# EasyEDA Pro project ProDocument_PCB_普通轴_wsad键盘布局_带灯版_2023-07-23.epro

# Board PCB_普通轴_wsad键盘布局_带灯版
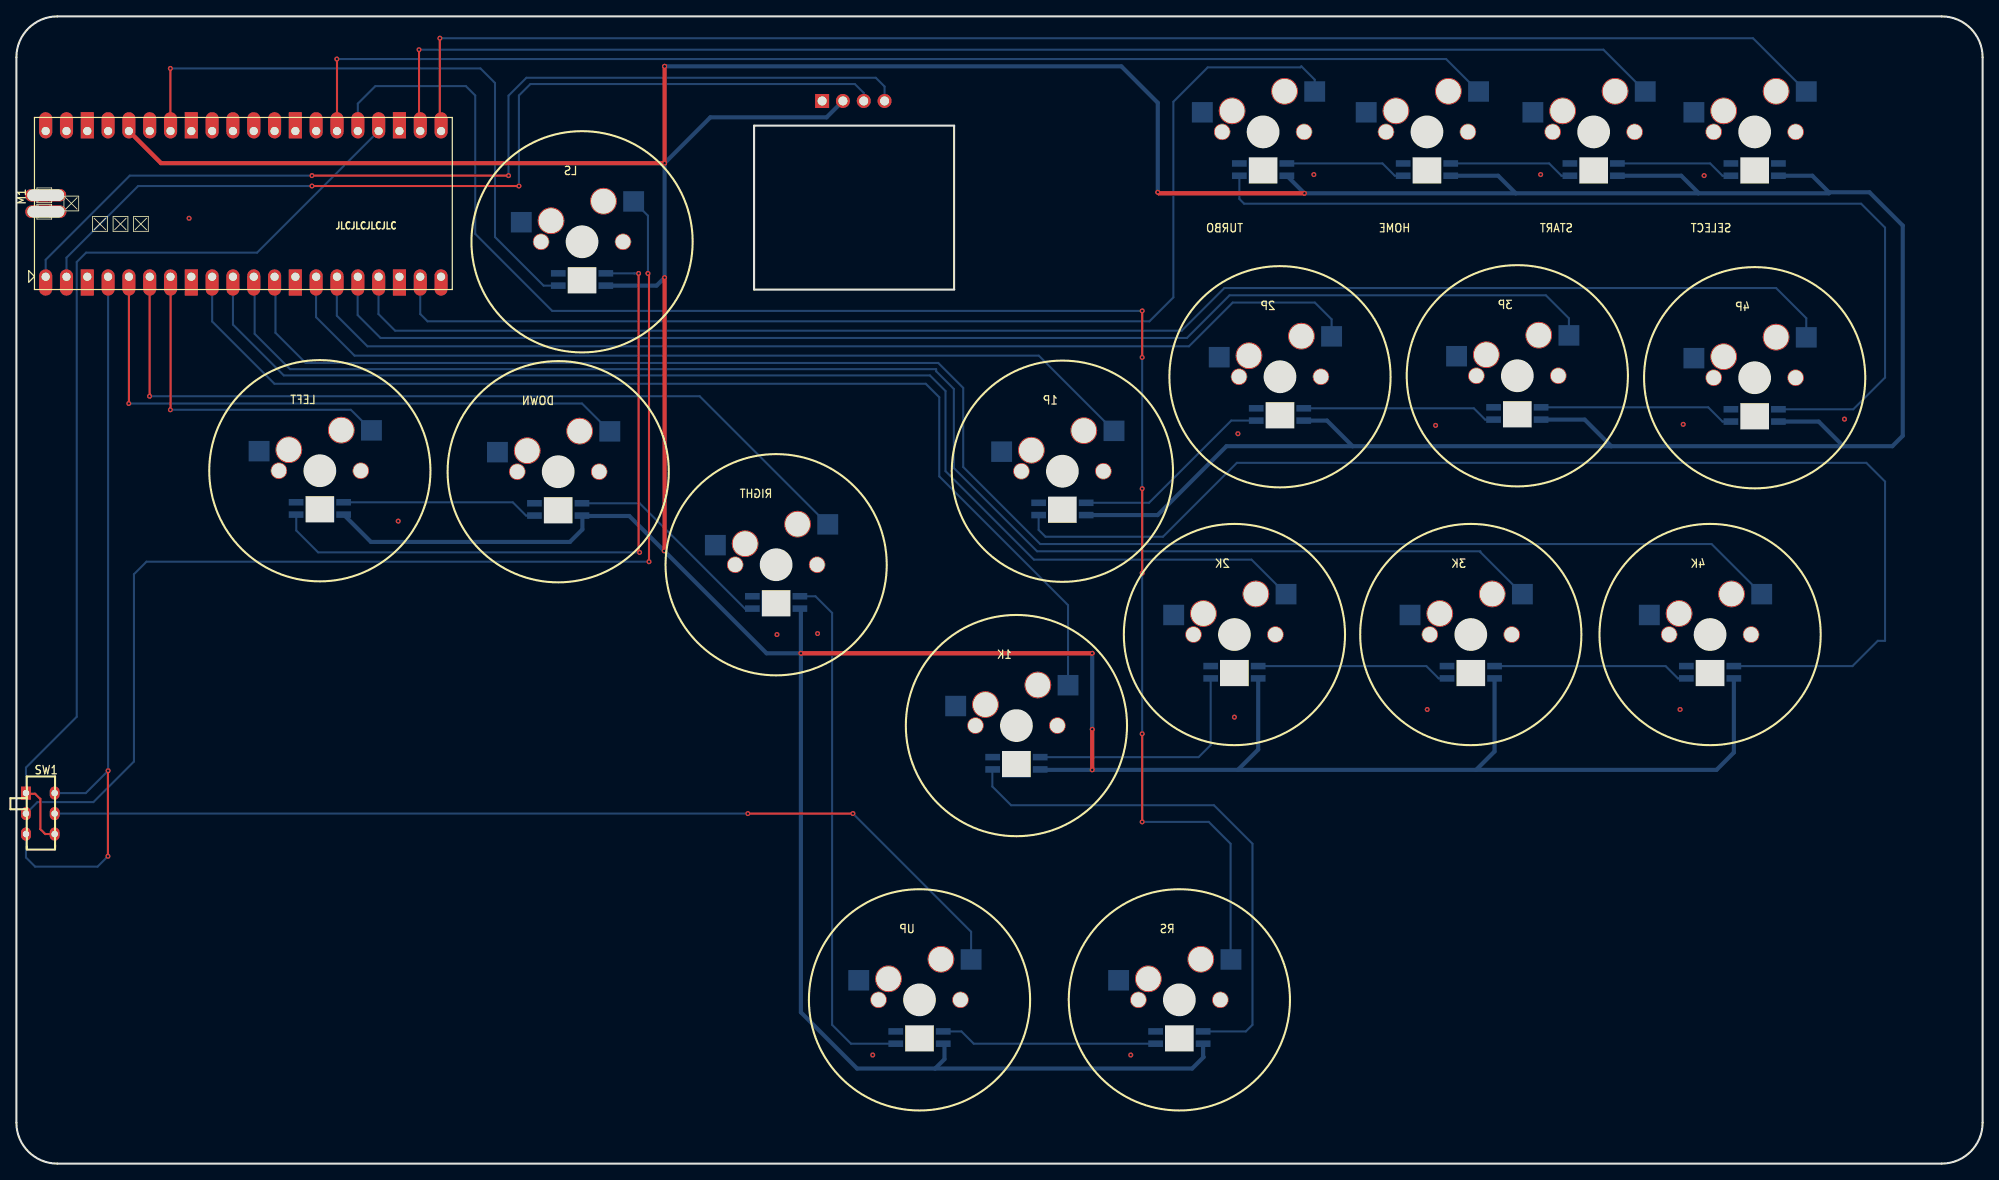
[diagram p0: board, top side]
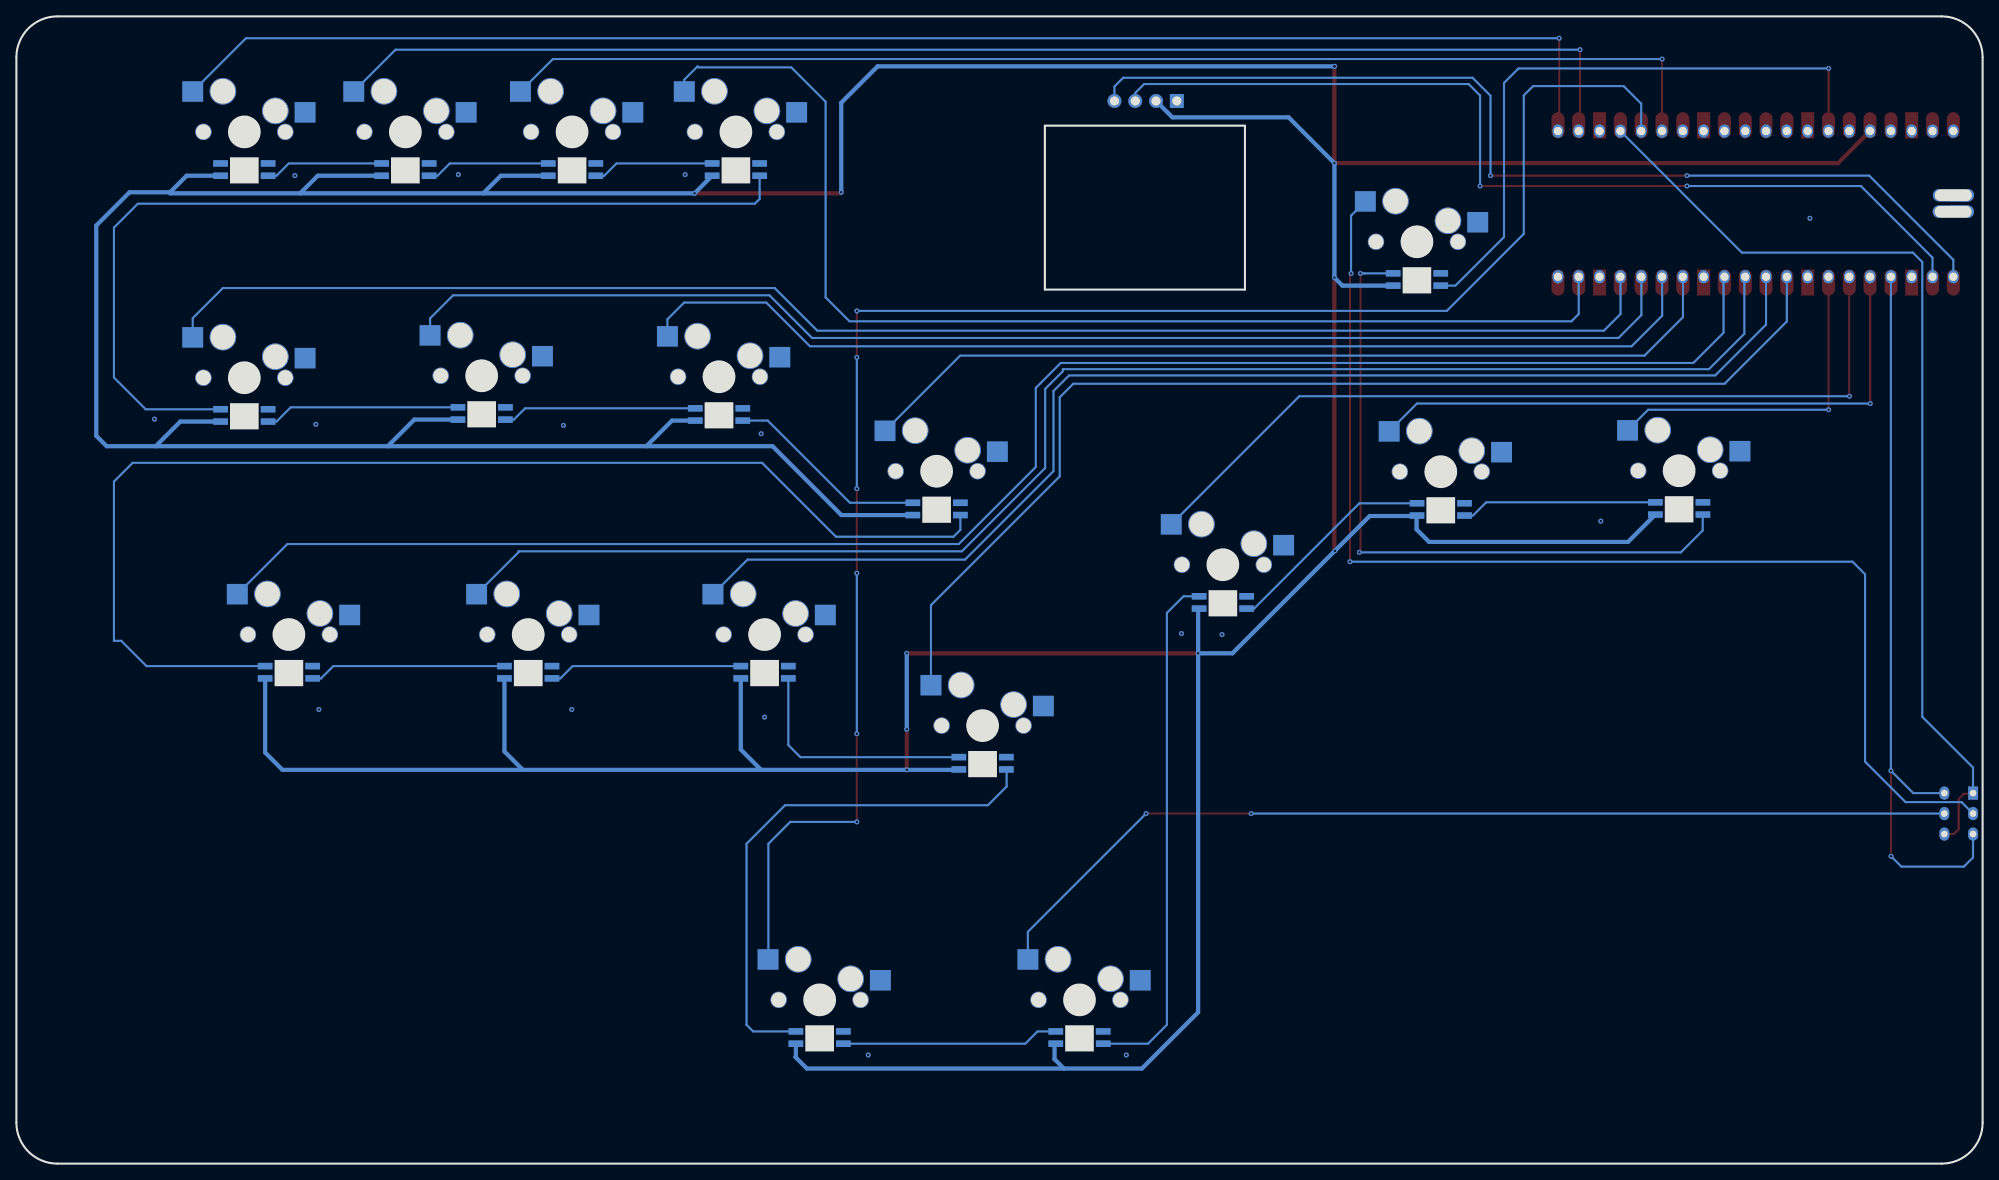
[diagram p1: board, bottom side, seen from below]

Outline 240 x 140 mm; copper layers: Top Layer, Bottom Layer. Coordinates in mm from the lower left corner of the outline.
Outline path: 0,135 arc(1.46,138.54) 5,140 235,140 arc(238.54,138.54) 240,135 240,5 arc(238.54,1.46) 235,0 5,0 arc(1.46,1.46) 0,5 0,135 ; 90.04,126.66 90.04,106.66 114.46,106.66 114.46,126.66 90.04,126.66
Stack: Top Layer 0.035mm - / Dielectric1 1.51mm FR4 er 4.5 / Bottom Layer 0.035mm -

## Design rules (mm)
template: 自定义配置
spacing copperThickness1oz (default): track to track 0.152, other pairs 0.152 to 0.3
spacing copperThickness2oz: track to track 0.203, other pairs 0.152 to 0.3
track width copperThickness1oz (default): min 0.127, default 0.254, max 2.54
track width copperThickness2oz: min 0.203, default 0.254, max 2.54
differential pair differentialPair (default): width min 0.127, default 0.254, max 2.54; gap min 0.152, default 0.152
via viaSize (default): diameter min 0.5, default 0.61, max 10; hole min 0.3, default 0.305, max 6.3

## Placement (name value [footprint] x y rotation side)
1K  1K  [焊接五脚轴1]  122.07 53.45 0 bottom
1P  1P  [焊接五脚轴1]  127.68 84.49 0 bottom
2K  2K  [焊接五脚轴1]  148.68 64.56 0 bottom
2P  2P  [焊接五脚轴1]  154.24 96.02 0 bottom
3K  3K  [焊接五脚轴1]  177.53 64.56 0 bottom
3P  3P  [焊接五脚轴1]  183.21 96.14 0 bottom
4K  4K  [焊接五脚轴1]  206.74 64.56 0 bottom
4P  4P  [焊接五脚轴1]  212.18 95.9 0 bottom
DOWN  S  [焊接五脚轴1]  66.14 84.43 0 bottom
H2  4PIN  [OLED-0.96]  88.41 131.18 0 top
HOME  HOME  [焊接五脚轴1]  172.18 125.9 0 bottom
LEFT  A  [焊接五脚轴1]  37.04 84.55 0 bottom
LS  W  [焊接五脚轴1]  69.05 112.49 0 bottom
M1  -  [PI PICO FIGHTING BOARD]  53.11 106.67 90 top
RIGHT  D  [焊接五脚轴1]  92.74 73.08 0 bottom
RS  W  [焊接五脚轴1]  141.95 19.98 0 bottom
SELECT  W  [焊接五脚轴1]  212.18 125.9 0 bottom
START  W  [焊接五脚轴1]  192.52 125.9 0 bottom
SW1  -  [拔动开关MSK-22D18(2P2T)六脚卧式]  2.92 42.72 0 top
TURBO  TURBO  [焊接五脚轴1]  152.18 125.9 0 bottom
UP  W  [焊接五脚轴1]  110.24 19.98 0 bottom

## Footprints (pads in the part's own frame, mm; a bottom-side part is the same pattern mirrored in y, then rotated)
OLED-0.96
  rect 1.7x1.7 hole 1.1: 1(9.94,-1.5)
  round 1.7 hole 1.1: 2(12.48,-1.5) 3(15.02,-1.5) 4(17.56,-1.5)
PI PICO FIGHTING BOARD
  oval 3.2x1.6 smd: 1(0.86,49.529) 2(0.86,46.99) 4(0.86,41.91) 5(0.86,39.37) 6(0.86,36.83) 7(0.86,34.289) 9(0.86,29.209) 10(0.86,26.669) 11(0.86,24.13) 12(0.86,21.59) 14(0.86,16.509) 15(0.86,13.97) 16(0.86,11.43) 17(0.86,8.889) 19(0.86,3.809) 20(0.86,1.27) 21(20.04,1.27) 22(20.04,3.809) 24(20.04,8.889) 25(20.04,11.43) 26(20.04,13.97) 27(20.04,16.509) 29(20.04,21.59) 30(20.04,24.13) 31(20.04,26.669) 32(20.04,29.209) 34(20.04,34.289) 35(20.04,36.83) 36(20.04,39.37) 37(20.04,41.91) 39(20.04,46.989) 40(20.04,49.529)
  rect 3.2x1.6 smd: 3(0.86,44.45) 8(0.86,31.75) 13(0.86,19.05) 18(0.86,6.35) 23(20.04,6.35) 28(20.04,19.05) 33(20.04,31.75) 38(20.04,44.45)
  oval 1.524x3.429 smd far side: 41(9.499,50.343) 42(11.506,50.343)
  oval 1.6x1.3 hole 1: 43(1.56,49.529) 44(1.56,46.989) 45(1.56,44.45) 46(1.56,41.91) 47(1.56,39.37) 48(1.56,36.83) 49(1.56,34.289) 50(1.56,16.509) 51(1.56,19.049) 52(1.56,21.59) 53(1.56,24.13) 54(1.56,26.669) 55(1.56,29.209) 56(1.56,31.75) 57(1.56,1.27) 58(1.56,3.809) 59(1.56,6.349) 60(1.56,8.889) 61(1.56,11.43) 62(1.56,13.97) 63(19.34,13.97) 64(19.34,11.43) 65(19.34,8.889) 66(19.34,6.349) 67(19.34,3.809) 68(19.34,1.27) 69(19.34,31.75) 70(19.34,29.209) 71(19.34,26.669) 72(19.34,24.13) 73(19.34,21.59) 74(19.34,19.049) 75(19.34,16.509) 76(19.34,34.289) 77(19.34,36.83) 78(19.34,39.37) 79(19.34,41.91) 80(19.34,44.45) 81(19.34,46.989) 82(19.34,49.529)
  oval 1.524x5 hole 1.397x4.5: 83(11.506,49.53) 84(9.499,49.505)
拔动开关MSK-22D18(2P2T)六脚卧式
  rect 1.2x1.6 hole 0.8: 1(-1.75,2.5)
  oval 1.2x1.6 hole 0.8: 2(-1.75,-0.001) 3(-1.75,-2.5) 4(1.75,-2.5) 5(1.75,-0.001) 6(1.75,2.5)
焊接五脚轴1
  rect 2.55x2.5 smd: 1(6.299,-4.928) 2(-7.417,-2.388)
  round 3.251 hole 3: 5(-3.784,-2.566) 8(2.616,-4.953)
  round 2 hole 1.8: 6(5,0) 7(-5,0)
  rect 1.8x0.8 smd: DIN(-2.9,5.351) DOUT(2.9,3.851) GND(-2.9,3.851) VCC(2.9,5.351)

## Nets
5V: M1.40 M1.82
GND: 1K.2 1K.GND 1P.2 1P.GND 2K.2 2K.GND 2P.2 2P.GND 3K.2 3K.GND 3P.2 3P.GND 4K.2 4K.GND 4P.2 4P.GND DOWN.2 DOWN.GND H2.1 HOME.2 HOME.GND LEFT.2 LEFT.GND LS.2 LS.GND M1.3 M1.8 M1.13 M1.18 M1.23 M1.28 M1.33 M1.38 M1.45 M1.51 M1.56 M1.59 M1.66 M1.69 M1.74 M1.80 RIGHT.2 RIGHT.GND RS.2 RS.GND SELECT.2 SELECT.GND START.2 START.GND TURBO.2 TURBO.GND UP.2 UP.GND
VCC: 1K.VCC 1P.VCC 2K.VCC 2P.VCC 3K.VCC 3P.VCC 4K.VCC 4P.VCC DOWN.VCC H2.2 HOME.VCC LEFT.VCC LS.VCC M1.36 M1.78 RIGHT.VCC RS.VCC SELECT.VCC START.VCC TURBO.VCC UP.VCC
1K: 1K.1 M1.9 M1.55
1P: 1P.1 M1.14 M1.50
2K: 2K.1 M1.10 M1.54
2P: 2P.1 M1.15 M1.62
3K: 3K.1 M1.11 M1.53
3P: 3P.1 M1.16 M1.61
4K: 4K.1 M1.12 M1.52
4P: 4P.1 M1.17 M1.60
$1K_DIN: 1K.DIN RS.DOUT
$1K_DOUT: 1K.DOUT 2K.DIN
$1P_DIN: 1P.DIN 4K.DOUT
$1P_DOUT: 1P.DOUT 2P.DIN
$2K_DOUT: 2K.DOUT 3K.DIN
$2P_DOUT: 2P.DOUT 3P.DIN
$3K_DOUT: 3K.DOUT 4K.DIN
$3P_DOUT: 3P.DOUT 4P.DIN
$4P_DOUT: 4P.DOUT TURBO.DIN
$DOWN_DIN: DOWN.DIN LEFT.DOUT
$DOWN_DOUT: DOWN.DOUT RIGHT.DIN
$HOME_DIN: HOME.DIN TURBO.DOUT
$HOME_DOUT: HOME.DOUT START.DIN
$LEFT_DIN: LEFT.DIN LS.DOUT
$LS_DIN: LS.DIN M1.34 M1.76
$RIGHT_DOUT: RIGHT.DOUT UP.DIN
$RS_DIN: RS.DIN UP.DOUT
$SELECT_DIN: SELECT.DIN START.DOUT
A: LEFT.1 M1.7 M1.49
D: M1.6 M1.48 RIGHT.1
HOME: HOME.1 M1.26 M1.63
LD: M1.24 M1.65 SW1.1 SW1.4
P: M1.27 M1.75
RD: M1.25 M1.64 RS.1
S: DOWN.1 M1.5 M1.47
SCL: H2.3 M1.2 M1.44
SDA: H2.4 M1.1 M1.43
SELECT: M1.21 M1.68 SELECT.1
START: M1.22 M1.67 START.1
SW1: SW1.5 UP.1
SW1-2: LS.1 SW1.2
T: M1.19 M1.58 TURBO.1
USB_D+: M1.41 M1.84
USB_D-: M1.42 M1.83
W: M1.4 M1.46 SW1.3 SW1.6

Pads without a net: 1K 5 6 7 8; 1P 5 6 7 8; 2K 5 6 7 8; 2P 5 6 7 8; 3K 5 6 7 8; 3P 5 6 7 8; 4K 5 6 7 8; 4P 5 6 7 8; DOWN 5 6 7 8; HOME 5 6 7 8; LEFT 5 6 7 8; LS 5 6 7 8; M1 20 29 30 31 32 35 37 39 57 70 71 72 73 77 79 81; RIGHT 5 6 7 8; RS 5 6 7 8; SELECT 5 6 7 8 DOUT; START 5 6 7 8; TURBO 5 6 7 8; UP 5 6 7 8

## Via types
v1: diameter 0.61, hole 0.305, Top Layer to Bottom Layer, 52 vias

## Routing (per net, layer and track width the routed paths; a pad name or vN(x,y) marks a point on that pad's centre or on a via; arc(x,y) is an arc through that point)
GND:
  vias: v1(21.08,115.36) v1(46.61,78.4) v1(92.84,64.56) v1(97.79,64.69) v1(104.52,13.25) v1(136.02,13.25) v1(148.68,54.48) v1(149.1,89.07) v1(158.37,120.7) v1(172.21,55.42) v1(173.23,90.09) v1(186.05,120.7) v1(203.07,55.42) v1(203.45,90.22) v1(206.01,120.57) v1(223.14,90.85)
VCC: length 851.9
  Top Layer w0.508: M1.78 17.65,122.09 v1(79.12,122.09) v1(79.12,133.9) ; v1(131.32,53) v1(131.32,48.05) ; v1(95.76,62.28) v1(131.32,62.28) ; v1(157.22,118.41) 139.45,118.41 v1(139.32,118.54) ; v1(79.12,108.12) 79.12,74.85
  Bottom Layer w0.508: 205.3,118.41 205.3,118.47 203.22,120.55 START.VCC ; 205.3,118.41 183.01,118.41 ; 205.3,118.41 221.23,118.41 221.23,118.54 ; SELECT.VCC 219.22,120.55 221.23,118.54 ; 222.99,87.55 194.67,87.55 ; 222.99,87.55 219.99,90.55 4P.VCC ; 222.99,87.55 228.98,87.55 230.25,88.82 230.25,114.47 226.19,118.54 221.23,118.54 ; 194.67,87.55 191.43,90.79 3P.VCC ; 194.67,87.55 163.1,87.55 ; 112.14,11.6 143.51,11.6 144.91,13 144.85,13.05 RS.VCC ; 112.14,11.6 113.28,12.75 113.28,14.49 UP.VCC ; 112.14,11.6 102.62,11.6 95.76,18.46 v1(95.76,62.28) ; 149.1,48.05 v1(131.32,48.05) 125.02,48.05 124.97,48.1 ; 149.1,48.05 151.58,50.53 2K.VCC ; 149.1,48.05 178.18,48.05 ; 69.09,79.03 74.81,79.03 v1(79.06,74.78) 91.57,62.28 v1(95.76,62.28) ; 69.09,79.03 69.09,77.39 67.56,75.86 43.28,75.86 LEFT.VCC ; 69.09,79.03 DOWN.VCC ; v1(139.32,118.54) 139.32,129.46 134.87,133.9 v1(79.12,133.9) ; v1(95.76,62.28) 95.76,67.61 RIGHT.VCC ; HOME.VCC 180.87,120.55 183.01,118.41 ; v1(131.32,62.28) v1(131.32,53) ; TURBO.VCC v1(157.22,118.41) 183.01,118.41 ; 163.1,87.55 159.97,90.67 2P.VCC ; 163.1,87.55 147.7,87.55 139.3,79.14 1P.VCC ; 4K.VCC 209.64,50.17 207.52,48.05 178.18,48.05 ; 178.18,48.05 180.43,50.3 3K.VCC ; LS.VCC 78.14,107.14 v1(79.12,108.12) v1(79.12,122.09) 84.71,127.68 98.89,127.68 H2.2
1K: length 139.7
  Bottom Layer w0.254: 1K.1 128.36,68.15 112.65,83.87 112.65,93.52 111,95.17 31.5,95.17 23.9,102.77 M1.55
1P: length 108.1
  Bottom Layer w0.254: 1P.1 124.8,98.6 41.28,98.6 36.58,103.3 36.58,108.21 M1.50
2K: length 153.7
  Bottom Layer w0.254: 2K.1 150.76,73.71 124.21,73.71 113.41,84.5 113.41,94.28 111.51,96.18 32.64,96.18 26.44,102.39 M1.54
2P: length 132.9
  Bottom Layer w0.254: M1.62 39.12,108.21 39.12,103.47 42.85,99.74 143.13,99.74 148.46,105.07 158.5,105.07 160.53,103.04 2P.1
3K: length 180.8
  Bottom Layer w0.254: M1.53 29.08,108.12 29.08,101.26 33.4,96.95 112.27,96.95 112.27,96.69 114.43,94.53 114.43,84.88 124.59,74.72 178.69,74.72 178.69,74.63 3K.1
3P: length 159.1
  Bottom Layer w0.254: M1.61 41.66,108.21 41.66,103.55 44.45,100.76 142.88,100.76 148.08,105.96 186.69,105.96 189.5,103.15 3P.1
4K: length 207.2
  Bottom Layer w0.254: M1.52 31.62,108.12 31.62,101.39 35.31,97.71 112.52,97.71 115.57,94.66 115.57,85.01 124.97,75.61 206.92,75.61 4K.1
4P: length 185.7
  Bottom Layer w0.254: M1.60 44.2,108.21 44.2,103.68 46.23,101.65 142.24,101.65 147.45,106.85 214.79,106.85 218.47,103.17 4P.1
$1K_DIN: length 65.2
  Bottom Layer w0.254: 1K.DIN 119.13,48.06 119.13,46.02 121.41,43.73 146.18,43.73 150.88,39.03 150.88,16.94 150.07,16.13 RS.DOUT
$1K_DOUT: length 29.6
  Bottom Layer w0.254: 124.97,49.6 144.3,49.6 145.78,51.08 2K.DIN
$1P_DIN: length 149.3
  Bottom Layer w0.254: 1P.DIN 124.78,77.34 125.61,76.5 139.95,76.5 148.97,85.52 225.81,85.52 228.09,83.23 228.09,63.8 227.2,63.8 224.12,60.71 4K.DOUT
$1P_DOUT: length 24.9
  Bottom Layer w0.254: 1P.DOUT 138.26,80.64 148.29,90.67 2P.DIN
$2K_DOUT: length 23.7
  Bottom Layer w0.254: 2K.DOUT 172.1,60.71 173.6,59.21 3K.DIN
$2P_DOUT: length 23.7
  Bottom Layer w0.254: 2P.DOUT 177.9,92.17 179.28,90.79 3P.DIN
$3K_DOUT: length 24
  Bottom Layer w0.254: 4K.DIN 202.81,59.21 201.31,60.71 3K.DOUT
$3P_DOUT: length 23.9
  Bottom Layer w0.254: 4P.DIN 208.25,90.55 206.51,92.29 3P.DOUT
$4P_DOUT: length 116
  Bottom Layer w0.254: TURBO.DIN 149.28,117.72 149.86,117.14 225.17,117.14 228.09,114.22 228.09,95.93 224.21,92.05 4P.DOUT
$DOWN_DIN: length 24
  Bottom Layer w0.254: DOWN.DIN 62.21,79.08 60.59,80.7 LEFT.DOUT
$DOWN_DOUT: length 26.1
  Bottom Layer w0.254: RIGHT.DIN 88.92,67.73 76.07,80.58 DOWN.DOUT
$HOME_DIN: length 14.8
  Bottom Layer w0.254: HOME.DIN 168.25,120.55 166.75,122.05 TURBO.DOUT
$HOME_DOUT: length 15.2
  Bottom Layer w0.254: START.DIN 188.59,120.55 187.09,122.05 HOME.DOUT
$LEFT_DIN: length 83.1
  Top Layer w0.254: v1(76.07,74.59) 75.95,74.72 v1(75.95,108.63)
  Bottom Layer w0.254: LS.DOUT 75.43,108.64 75.44,108.63 v1(75.95,108.63) ; LEFT.DIN 34.16,79.18 34.16,77.26 36.83,74.59 v1(76.07,74.59)
$LS_DIN: length 76.3
  Top Layer w0.254: v1(18.8,133.65) 18.8,126.73 M1.34
  Bottom Layer w0.254: v1(18.8,133.65) 56.64,133.65 58.42,131.87 58.42,113.08 64.35,107.14 LS.DIN
$RIGHT_DOUT: length 63.8
  Bottom Layer w0.254: RIGHT.DOUT 97.54,69.23 99.57,67.2 99.57,16.94 101.87,14.63 UP.DIN
$RS_DIN: length 26.5
  Bottom Layer w0.254: RS.DIN 116.86,14.63 115.36,16.13 UP.DOUT
$SELECT_DIN: length 14.5
  Bottom Layer w0.254: SELECT.DIN 208.25,120.55 206.75,122.05 START.DOUT
A: length 41.8
  Top Layer w0.254: M1.49 18.82,92.01 v1(18.8,91.99)
  Bottom Layer w0.254: v1(18.8,91.99) 40.83,91.99 LEFT.1
D: length 103.8
  Top Layer w0.254: M1.48 16.28,93.66 v1(16.26,93.64)
  Bottom Layer w0.254: RIGHT.1 83.4,93.64 v1(16.26,93.64)
HOME: length 149.8
  Top Layer w0.254: M1.63 39.14,134.77 v1(39.12,134.79)
  Bottom Layer w0.254: HOME.1 174.51,134.79 v1(39.12,134.79)
LD: length 118.6
  Top Layer w0.254: SW1.4 3.52,40.22 2.92,40.81 2.92,44.5 2.29,45.13 1.26,45.13 SW1.1
  Bottom Layer w0.254: M1.65 29.38,111.17 8.51,111.17 7.37,110.03 7.37,54.53 1.17,48.33 SW1.1
RD: length 209.6
  Top Layer w0.254: v1(137.41,98.39) v1(137.41,104.06) ; v1(137.41,41.7) v1(137.41,52.45) ; v1(137.41,72.05) v1(137.41,82.36)
  Bottom Layer w0.254: M1.64 41.68,129.35 43.81,131.49 54.86,131.49 56.01,130.35 56.01,113.46 65.41,104.06 v1(137.41,104.06) ; v1(137.41,72.05) v1(137.41,52.45) ; RS.1 148.21,24.96 148.21,39.03 145.54,41.7 v1(137.41,41.7) ; v1(137.41,98.39) v1(137.41,82.36)
S: length 75.6
  Top Layer w0.254: v1(13.72,92.76) 13.74,92.77 M1.47
  Bottom Layer w0.254: v1(13.72,92.76) 69.04,92.76 DOWN.1
SCL: length 116.3
  Top Layer w0.254: v1(61.34,119.3) v1(36.08,119.3)
  Bottom Layer w0.254: v1(61.34,119.3) 61.34,130.35 62.74,131.74 102.34,131.74 103.43,130.65 H2.3 ; v1(36.08,119.3) 14.86,119.3 6.12,110.55 M1.44
SDA: length 121.6
  Top Layer w0.254: v1(60.07,120.57) v1(36.08,120.57)
  Bottom Layer w0.254: v1(36.08,120.57) 13.84,120.57 3.58,110.3 M1.43 ; H2.4 105.97,131.44 104.9,132.51 62.25,132.51 60.07,130.33 v1(60.07,120.57)
SELECT: length 180.2
  Top Layer w0.254: v1(51.69,137.33) 51.69,126.85 M1.21
  Bottom Layer w0.254: v1(51.69,137.33) 211.97,137.33 SELECT.1
START: length 161.1
  Top Layer w0.254: M1.22 49.15,126.85 v1(49.15,135.94)
  Bottom Layer w0.254: START.1 193.72,135.94 v1(49.15,135.94)
SW1: length 121.2
  Top Layer w0.254: 102.11,42.72 v1(89.28,42.72)
  Bottom Layer w0.254: v1(102.11,42.72) 116.54,28.29 UP.1 ; v1(89.28,42.72) SW1.5
SW1-2: length 146.9
  Top Layer w0.254: v1(77.09,108.63) 77.22,108.5 v1(77.22,73.45)
  Bottom Layer w0.254: v1(77.22,73.45) 15.88,73.45 14.35,71.93 14.35,49.07 9.4,44.11 2.57,44.11 SW1.2 ; v1(77.09,108.63) 77.09,115.68 LS.1
T: length 143.1
  Bottom Layer w0.254: TURBO.1 158.47,132.27 156.84,133.9 156.72,133.78 145.41,133.78 141.22,129.59 141.22,105.71 138.3,102.79 50.18,102.79 49.3,103.68 M1.58
W: length 92.2
  Top Layer w0.254: v1(11.2,47.94) 11.18,47.92 v1(11.18,37.51)
  Bottom Layer w0.254: v1(11.18,37.51) 9.91,36.24 2.29,36.24 1.17,37.36 SW1.3 ; M1.46 v1(11.2,47.94) 8.47,45.22 SW1.6

## Copper pours and planes (outline as drawn; the poured copper is in the pictures)
GND on Top Layer: -18.92,149.27 256.03,149.27 256.03,-12.91 -18.92,-12.91
GND on Bottom Layer: -8,144.44 248.54,144.44 248.54,-6.94 -8,-6.94

## Text on the board
Top Silkscreen Layer: JLCJLCJLCJLC
